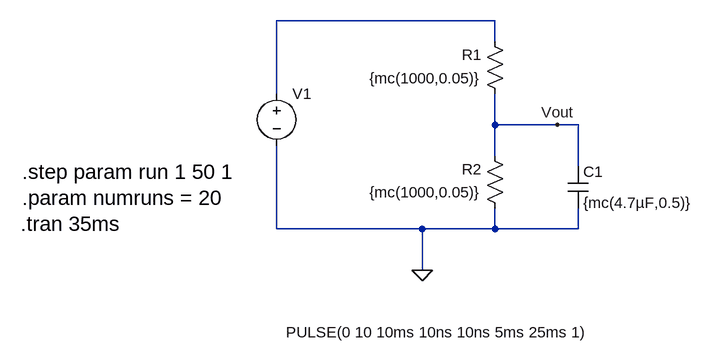
[diagram p0: schematic Simple Monte Carlo.asc]
Simple Monte Carlo.asc, the LTspice schematic file:
Version 4
SHEET 1 880 680
WIRE 224 16 -112 16
WIRE 224 48 224 16
WIRE -112 128 -112 16
WIRE 224 176 224 128
WIRE 320 176 224 176
WIRE 352 176 320 176
WIRE 224 224 224 176
WIRE 352 240 352 176
WIRE -112 336 -112 208
WIRE 112 336 -112 336
WIRE 224 336 224 304
WIRE 224 336 112 336
WIRE 352 336 352 304
WIRE 352 336 224 336
WIRE 112 400 112 336
FLAG 112 400 0
FLAG 320 176 Vout
SYMBOL voltage -112 112 R0
WINDOW 3 14 383 Left 2
WINDOW 123 0 0 Left 0
WINDOW 39 0 0 Left 0
SYMATTR InstName V1
SYMATTR Value PULSE(0 10 10ms 10ns 10ns 5ms 25ms 1)
SYMBOL res 240 144 R180
WINDOW 0 36 76 Left 2
WINDOW 3 36 40 Left 2
SYMATTR InstName R1
SYMATTR Value {mc(1000,0.05)}
SYMATTR SpiceLine pwr=0.1
SYMBOL res 240 320 R180
WINDOW 0 36 76 Left 2
WINDOW 3 36 40 Left 2
SYMATTR InstName R2
SYMATTR Value {mc(1000,0.05)}
SYMBOL cap 336 240 R0
SYMATTR InstName C1
SYMATTR Value {mc(4.7µF,0.5)}
SYMATTR SpiceLine V=2.7V
TEXT -506 328 Left 3 !.tran 35ms
TEXT -504 288 Left 3 !.param numruns = 20
TEXT -504 248 Left 3 !.step param run 1 50 1

The netlist it stands for:
* Simple Monte Carlo.asc
V1 N001 0 PULSE(0 10 10ms 10ns 10ns 5ms 25ms 1)
R1 Vout N001 {mc(1000,0.05)} pwr=0.1
R2 0 Vout {mc(1000,0.05)}
C1 Vout 0 {mc(4.7µF,0.5)} V=2.7V
.tran 35ms
.param numruns = 20
.step param run 1 50 1
.backanno
.end